# Altium project eggubator.PrjPcb
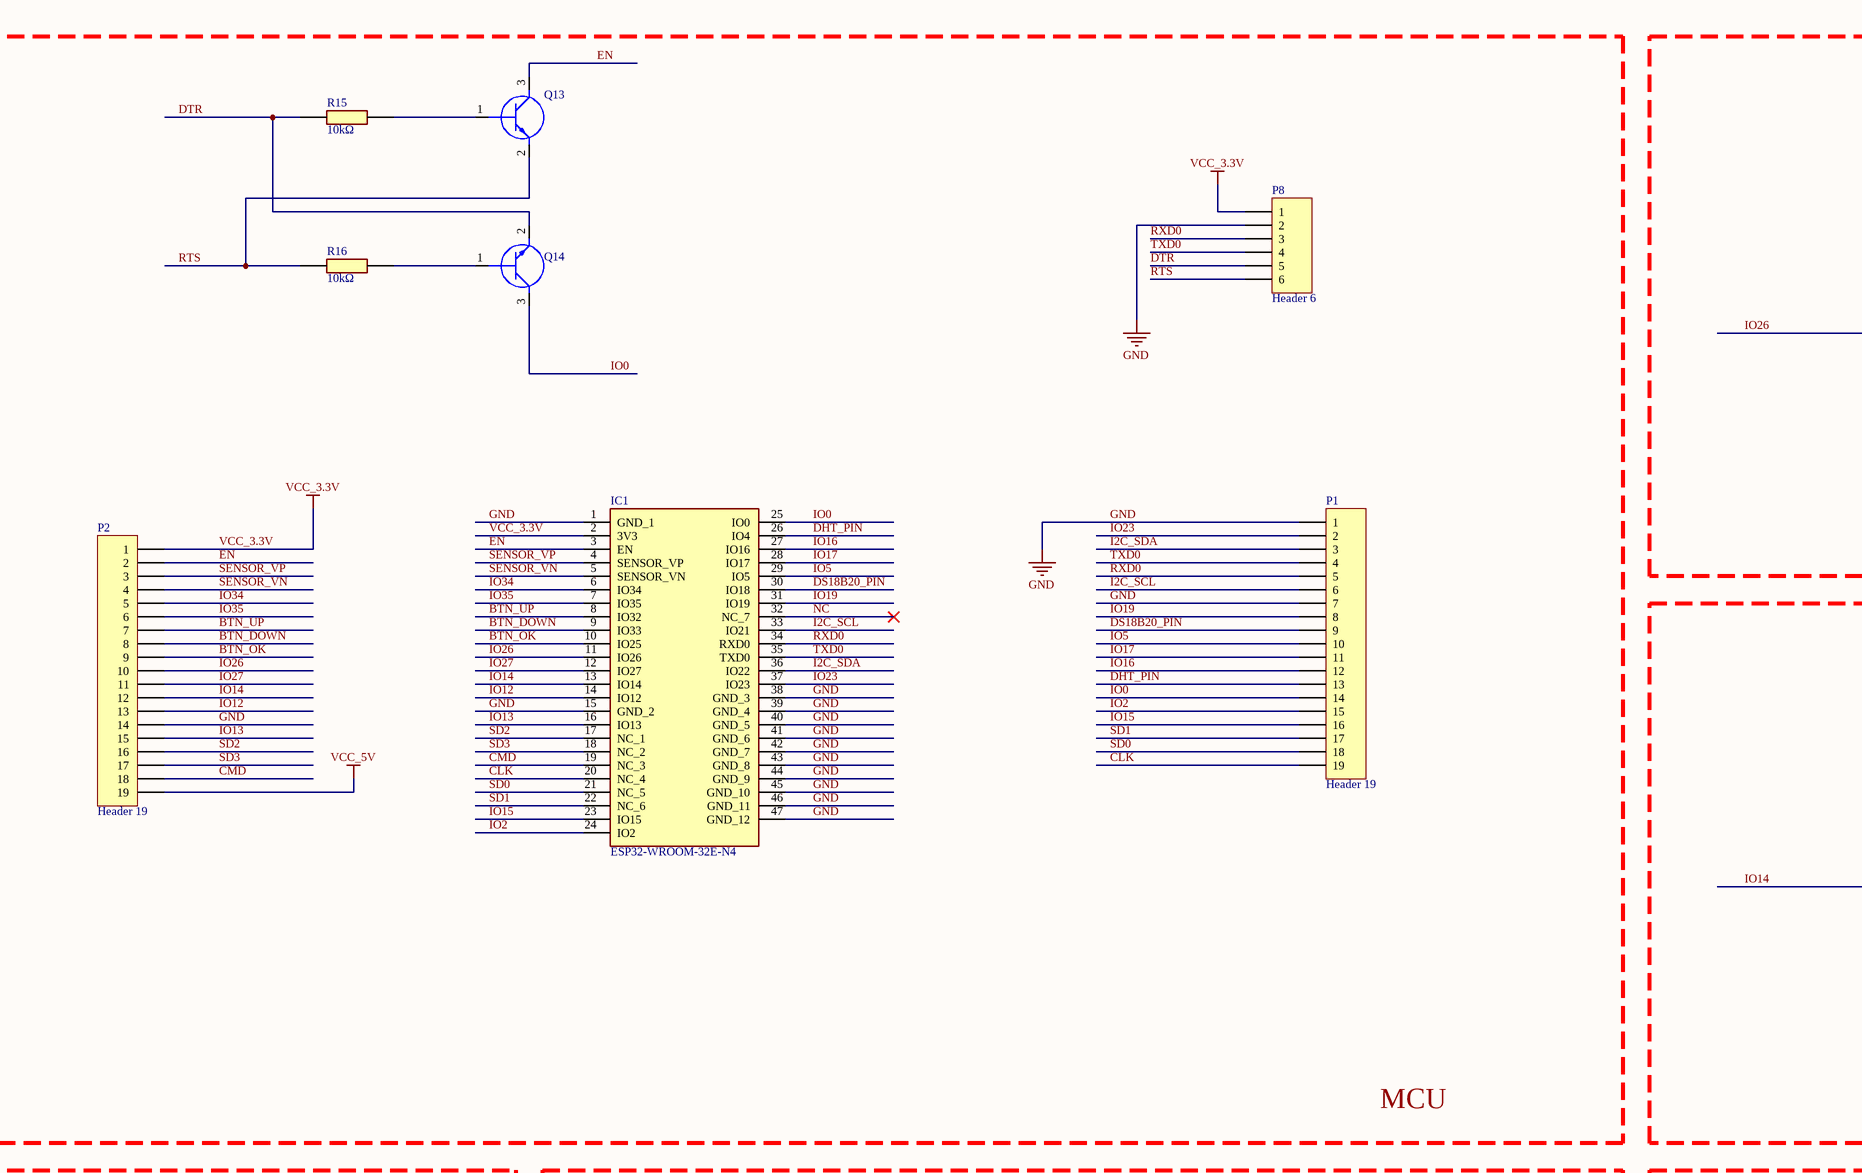
[diagram p0: MCU.SchDoc, top left]
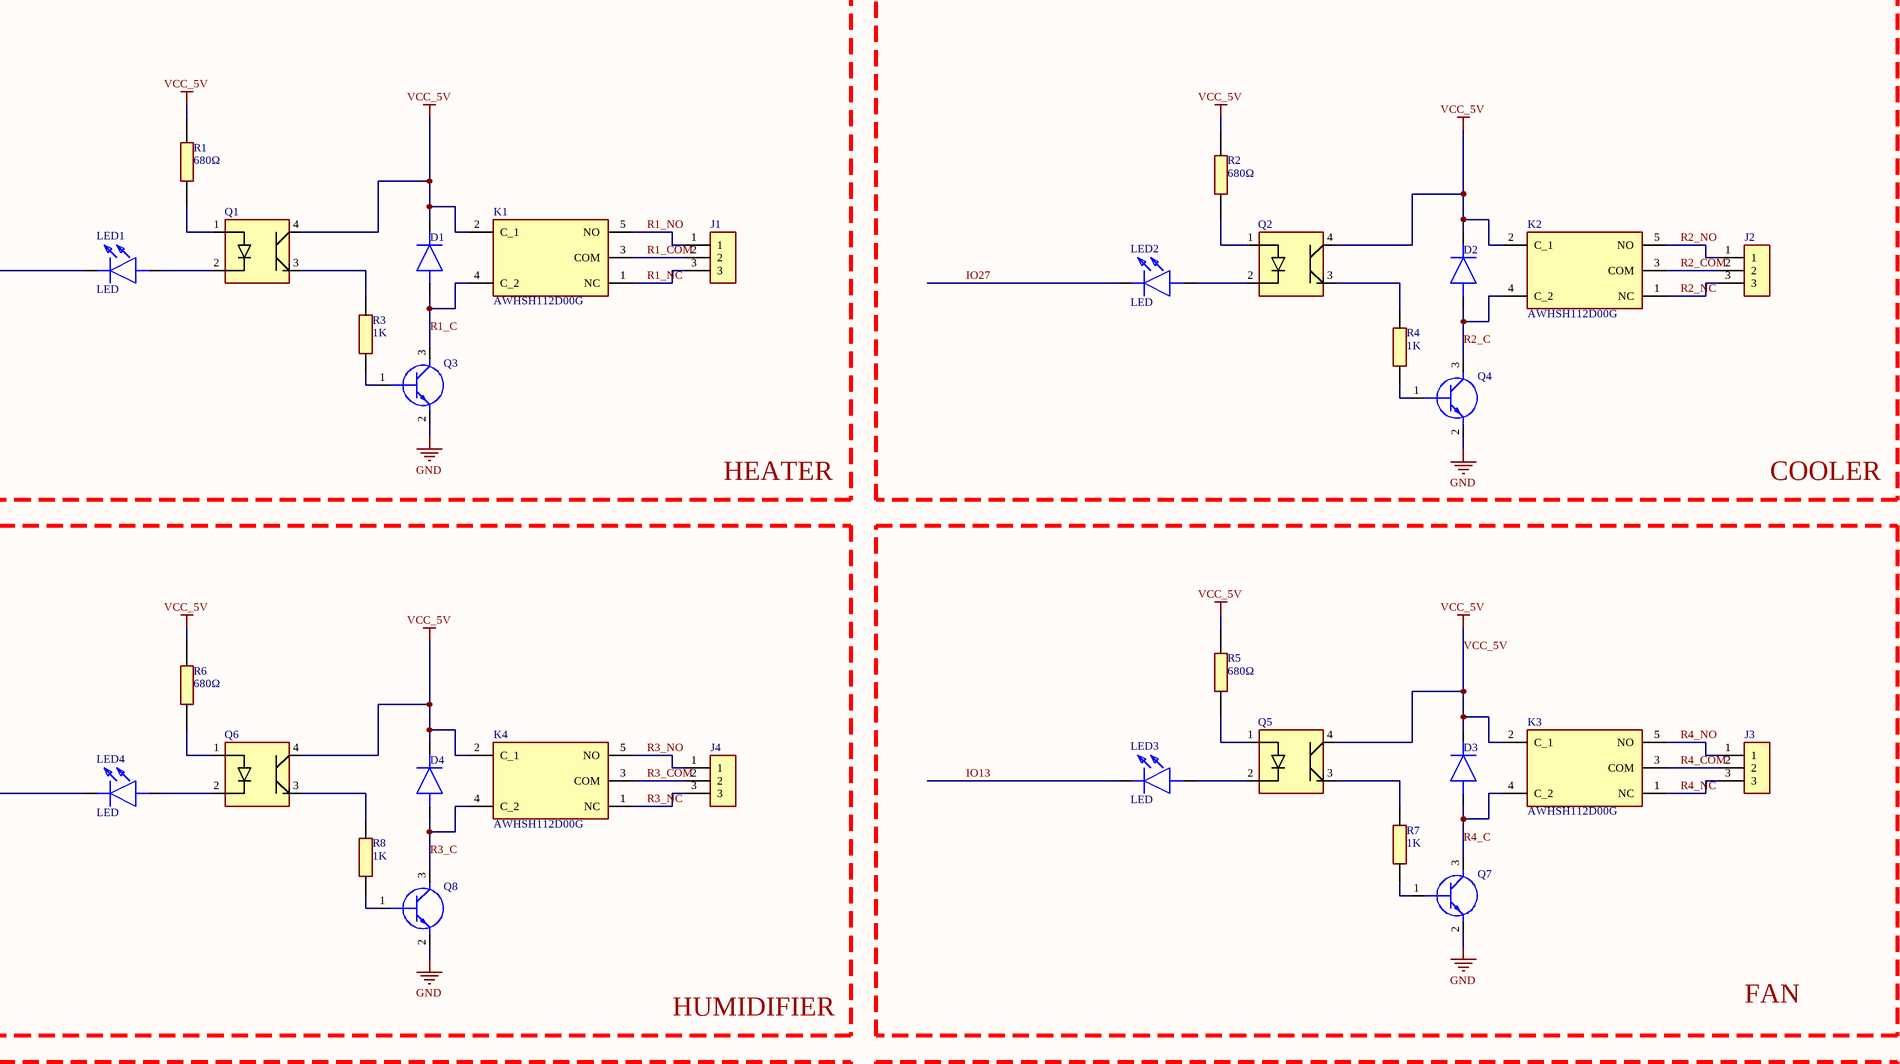
[diagram p1: MCU.SchDoc, top right]
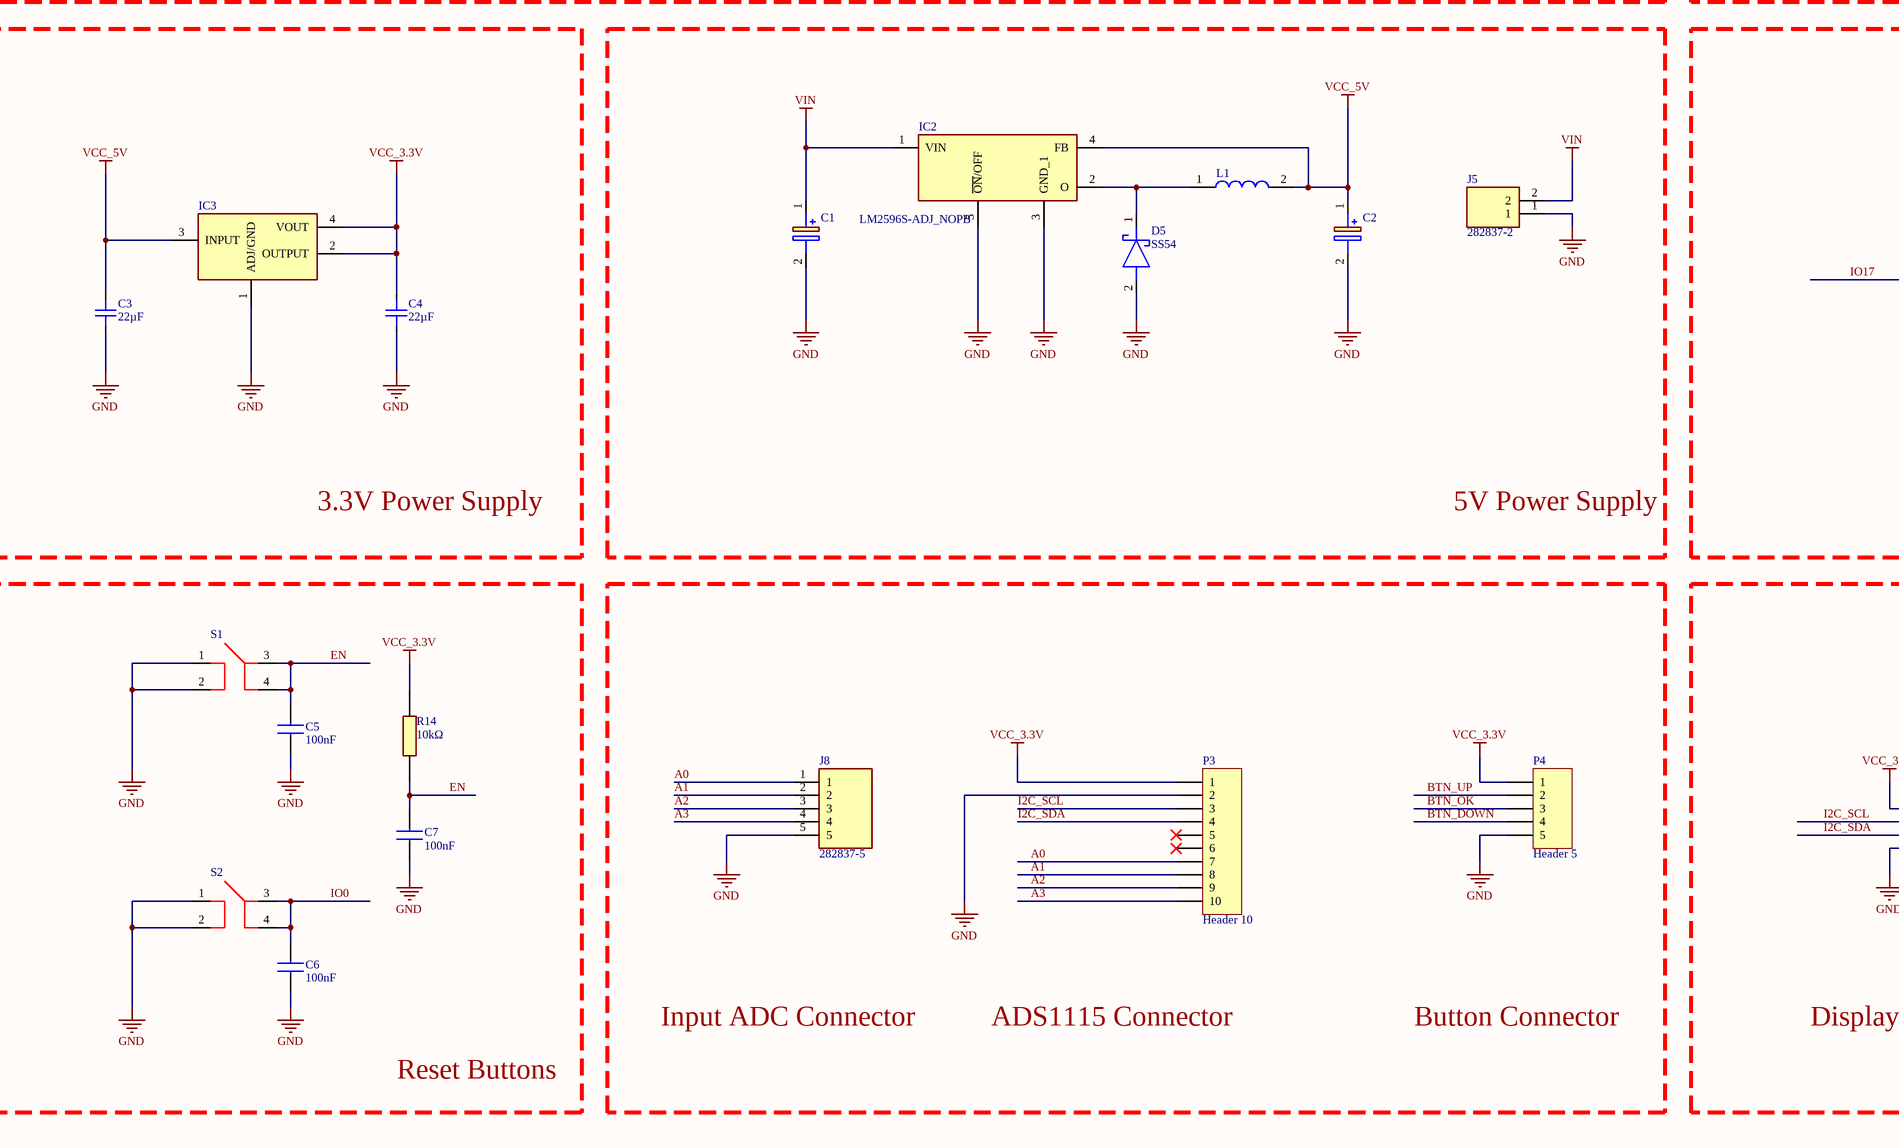
[diagram p2: MCU.SchDoc, bottom left]
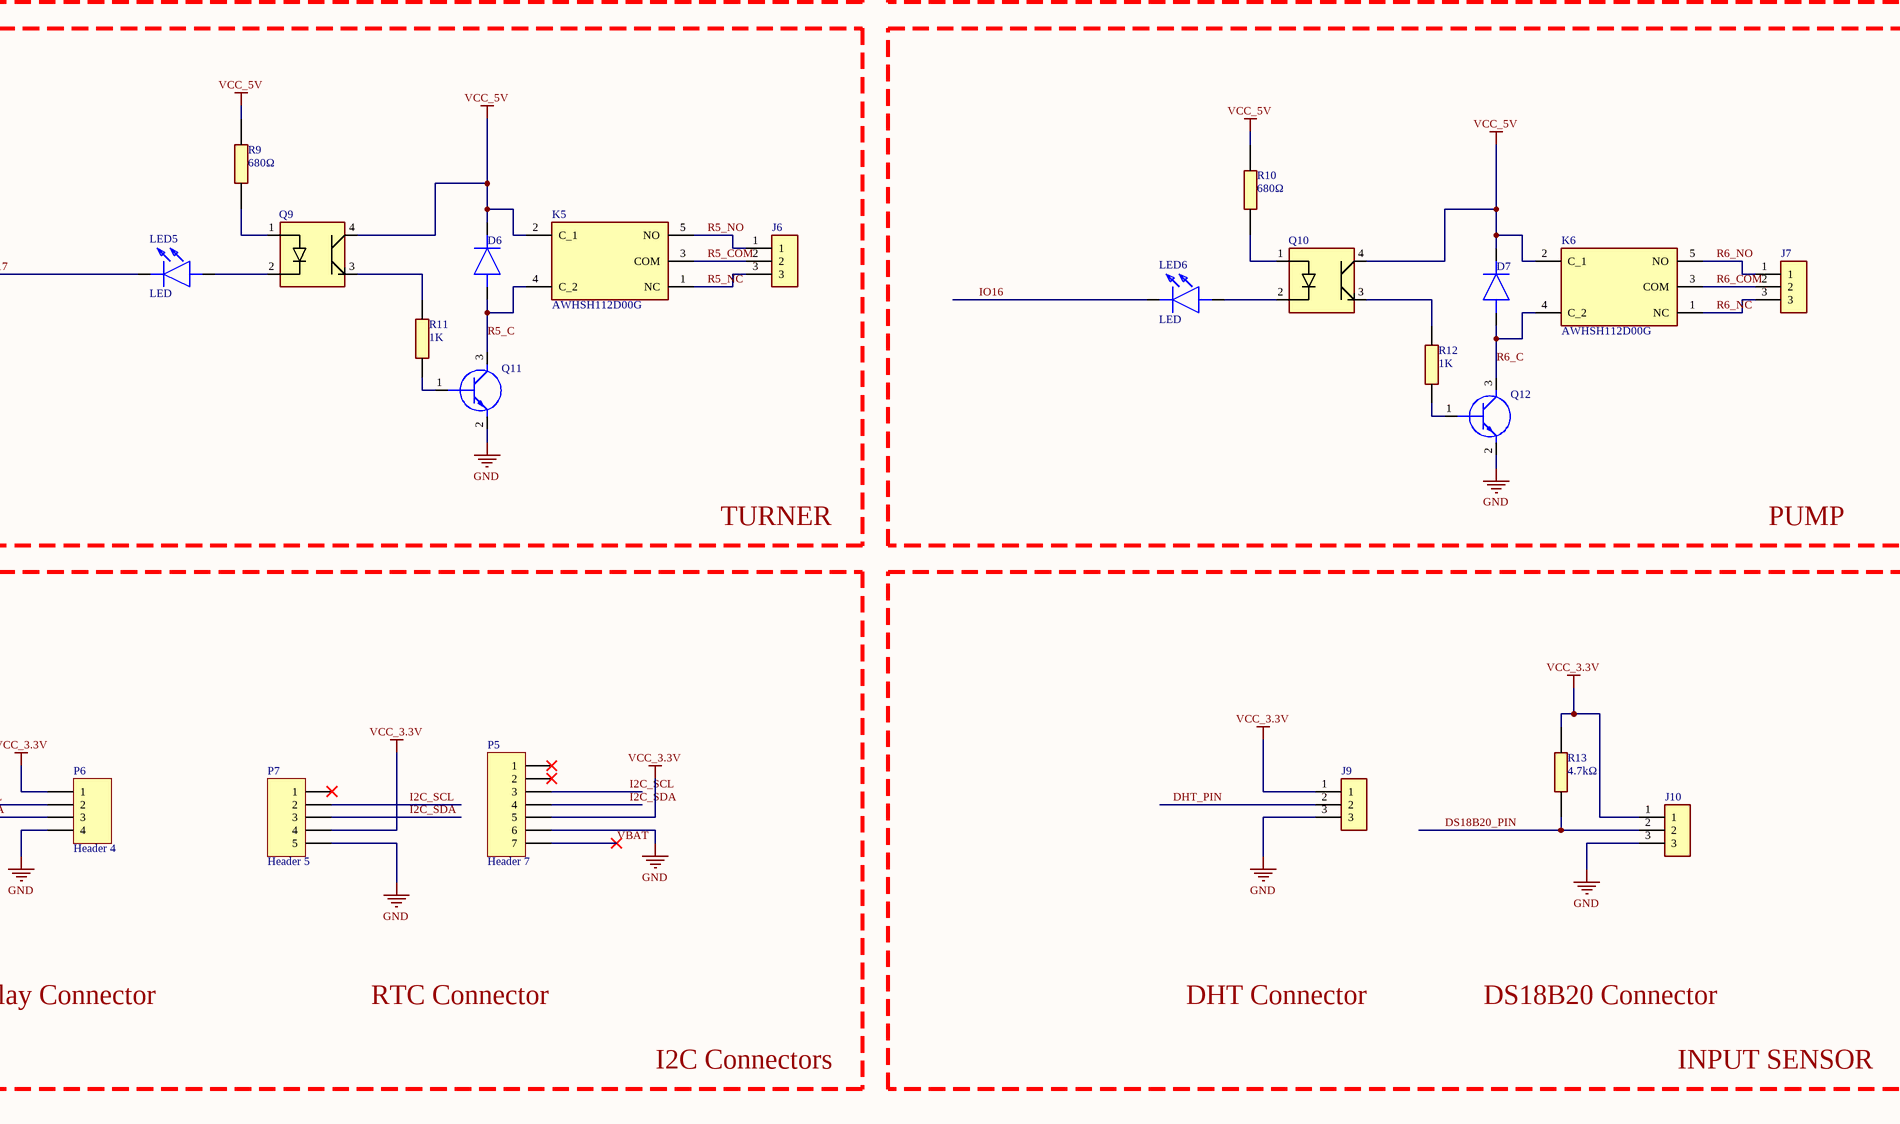
[diagram p3: MCU.SchDoc, bottom right]
1 sheet, 80 parts. Net scope: global (net labels, ports and power ports of the same name join across sheets).
Board file: eggubator.PcbDoc

## Sheet MCU.SchDoc
size A1; SheetNumber: 1; SheetTotal: 1

### Parts
C1  865060453007  [CAPAE830X1050N]  (value not drawn)
C2  865060453007  [CAPAE830X1050N]  (value not drawn)
C3  22µF  [C0805]
C4  22µF  [C0805]
C5  100nF  [C0805]
C6  100nF  [C0805]
C7  100nF  [C0805]
D1  1N4007FLTR  [SODFL3718X140N]  (value not drawn)
D2  1N4007FLTR  [SODFL3718X140N]  (value not drawn)
D3  1N4007FLTR  [SODFL3718X140N]  (value not drawn)
D4  1N4007FLTR  [SODFL3718X140N]  (value not drawn)
D5  SS54  [DIOM5026X262N]
D6  1N4007FLTR  [SODFL3718X140N]  (value not drawn)
D7  1N4007FLTR  [SODFL3718X140N]  (value not drawn)
IC1  ESP32-WROOM-32E-N4  [ESP32WROOM32EN4]
IC2  LM2596S-ADJ_NOPB  [LM2596SXADJ]
IC3  LM1117IMPX3.3_NOPB  [SOT230P700X180-4N]  (value not drawn)
J1  691137710003  [691137710003]  (value not drawn)
J2  691137710003  [691137710003]  (value not drawn)
J3  691137710003  [691137710003]  (value not drawn)
J4  691137710003  [691137710003]  (value not drawn)
J5  282837-2  [2828372]
J6  691137710003  [691137710003]  (value not drawn)
J7  691137710003  [691137710003]  (value not drawn)
J8  282837-5  [2828375]
J9  691137710003  [691137710003]  (value not drawn)
J10  691137710003  [691137710003]  (value not drawn)
K1  AWHSH112D00G  [AWHSH112D00G]
K2  AWHSH112D00G  [AWHSH112D00G]
K3  AWHSH112D00G  [AWHSH112D00G]
K4  AWHSH112D00G  [AWHSH112D00G]
K5  AWHSH112D00G  [AWHSH112D00G]
K6  AWHSH112D00G  [AWHSH112D00G]
L1  CDRH104RNP-331NC  [CDRH104RNP331NC]  (value not drawn)
LED1  LED  [XZMDK54W4]
LED2  LED  [XZMDK54W4]
LED3  LED  [XZMDK54W4]
LED4  LED  [XZMDK54W4]
LED5  LED  [XZMDK54W4]
LED6  LED  [XZMDK54W4]
P1  Header 19  [HDR1X19]
P2  Header 19  [HDR1X19]
P3  Header 10  [HDR1X10]
P4  Header 5  [HDR1X5]
P5  Header 7  [HDR1X7]
P6  Header 4  [HDR1X4]
P7  Header 5  [HDR1X5]
P8  Header 6  [HDR1X6]
Q1  APC-817C1-SL  [APC817C1SL]  (value not drawn)
Q2  APC-817C1-SL  [APC817C1SL]  (value not drawn)
Q3  MMBT2222A-G  [SOT95P240X115-3N]  (value not drawn)
Q4  MMBT2222A-G  [SOT95P240X115-3N]  (value not drawn)
Q5  APC-817C1-SL  [APC817C1SL]  (value not drawn)
Q6  APC-817C1-SL  [APC817C1SL]  (value not drawn)
Q7  MMBT2222A-G  [SOT95P240X115-3N]  (value not drawn)
Q8  MMBT2222A-G  [SOT95P240X115-3N]  (value not drawn)
Q9  APC-817C1-SL  [APC817C1SL]  (value not drawn)
Q10  APC-817C1-SL  [APC817C1SL]  (value not drawn)
Q11  MMBT2222A-G  [SOT95P240X115-3N]  (value not drawn)
Q12  MMBT2222A-G  [SOT95P240X115-3N]  (value not drawn)
Q13  MMBT2222A-G  [SOT95P240X115-3N]  (value not drawn)
Q14  MMBT2222A-G  [SOT95P240X115-3N]  (value not drawn)
R1  680Ω  [RES 0805_2012 RF]
R2  680Ω  [RES 0805_2012 RF]
R3  1K  [RESC2012X60N]
R4  1K  [RESC2012X60N]
R5  680Ω  [RES 0805_2012 RF]
R6  680Ω  [RES 0805_2012 RF]
R7  1K  [RESC2012X60N]
R8  1K  [RESC2012X60N]
R9  680Ω  [RES 0805_2012 RF]
R10  680Ω  [RES 0805_2012 RF]
R11  1K  [RESC2012X60N]
R12  1K  [RESC2012X60N]
R13  4.7kΩ  [RES 0805_2012 RF]
R14  10kΩ  [RESC2012X60N]
R15  10kΩ  [RESC2012X60N]
R16  10kΩ  [RESC2012X60N]
S1  TL1105AF160Q  [TL1105AF160Q]  (value not drawn)
S2  TL1105AF160Q  [TL1105AF160Q]  (value not drawn)

### Blocks framed on the sheet
MCU: IC1 P1 P2 P8 Q13 Q14 R15 R16
HEATER: D1 J1 K1 LED1 Q1 Q3 R1 R3
COOLER: D2 J2 K2 LED2 Q2 Q4 R2 R4
HUMIDIFIER: D4 J4 K4 LED4 Q6 Q8 R6 R8
FAN: D3 J3 K3 LED3 Q5 Q7 R5 R7
3.3V Power Supply: C3 C4 IC3
5V Power Supply: C1 C2 D5 IC2 J5 L1
TURNER: D6 J6 K5 LED5 Q9 Q11 R9 R11
PUMP: D7 J7 K6 LED6 Q10 Q12 R10 R12
Reset Buttons: C5-C7 R14 S1 S2

### Nets
GND: C1.2(-) C2.2(-) C3.1 C4.1 C5.2 C6.2 C7.2 D5.2(A) IC1.1(GND_1) IC1.15(GND_2) IC1.38(GND_3) IC1.39(GND_4) IC1.40(GND_5) IC1.41(GND_6) IC1.42(GND_7) IC1.43(GND_8) IC1.44(GND_9) IC1.45(GND_10) IC1.46(GND_11) IC1.47(GND_12) IC2.3(GND_1) IC2.5(~{ON}/OFF) IC3.1(ADJ/GND) J5.1 J8.5 J9.3 J10.3 P1.1 P1.7 P2.14 P3.2 P4.5 P5.6 P6.4 P7.5 P8.2 Q3.2(E) Q4.2(E) Q7.2(E) Q8.2(E) Q11.2(E) Q12.2(E) S1.1(COM_1) S1.2(COM_2) S2.1(COM_1) S2.2(COM_2)
VCC_3.3V: C4.2 IC1.2(3V3) IC3.2(OUTPUT) IC3.4(VOUT) J9.1 J10.1 P2.1 P3.1 P4.1 P5.5 P6.1 P7.4 P8.1 R13.2 R14.2
VCC_5V: C2.1(+) C3.2 D1.1(K) D2.1(K) D3.1(K) D4.1(K) D6.1(K) D7.1(K) IC2.4(FB) IC3.3(INPUT) K1.2(C_1) K2.2(C_1) K3.2(C_1) K4.2(C_1) K5.2(C_1) K6.2(C_1) L1.2 P2.19 Q1.4(COLLECTOR) Q2.4(COLLECTOR) Q5.4(COLLECTOR) Q6.4(COLLECTOR) Q9.4(COLLECTOR) Q10.4(COLLECTOR) R1.2 R2.2 R5.2 R6.2 R9.2 R10.2
VIN: C1.1(+) IC2.1(VIN) J5.2
A0: J8.1 P3.7
A1: J8.2 P3.8
A2: J8.3 P3.9
A3: J8.4 P3.10
BTN_DOWN: IC1.9(IO33) P2.8 P4.4
BTN_OK: IC1.10(IO25) P2.9 P4.3
BTN_UP: IC1.8(IO32) P2.7 P4.2
CLK: IC1.20(NC_4) P1.19
CMD: IC1.19(NC_3) P2.18
DHT_PIN: IC1.26(IO4) J9.2 P1.13
DS18B20_PIN: IC1.30(IO18) J10.2 P1.9 R13.1
DTR: P8.5 Q14.2(E) R15.2
EN: C5.1 C7.1 IC1.3(EN) P2.2 Q13.3(C) R14.1 S1.3(NO_1) S1.4(NO_2)
I2C_SCL: IC1.33(IO21) P1.6 P3.3 P5.3 P6.2 P7.2
I2C_SDA: IC1.36(IO22) P1.3 P3.4 P5.4 P6.3 P7.3
IO0: C6.1 IC1.25(IO0) P1.14 Q14.3(C) S2.3(NO_1) S2.4(NO_2)
IO2: IC1.24(IO2) P1.15
IO5: IC1.29(IO5) P1.10
IO12: IC1.14(IO12) P2.13
IO13: IC1.16(IO13) LED3.1(K) P2.15
IO14: IC1.13(IO14) LED4.1(K) P2.12
IO15: IC1.23(IO15) P1.16
IO16: IC1.27(IO16) LED6.1(K) P1.12
IO17: IC1.28(IO17) LED5.1(K) P1.11
IO19: IC1.31(IO19) P1.8
IO23: IC1.37(IO23) P1.2
IO26: IC1.11(IO26) LED1.1(K) P2.10
IO27: IC1.12(IO27) LED2.1(K) P2.11
IO34: IC1.6(IO34) P2.5
IO35: IC1.7(IO35) P2.6
NC: IC1.32(NC_7)
R1_C: D1.2(A) K1.4(C_2) Q3.3(C)
R1_COM: J1.2 K1.3(COM)
R1_NC: J1.3 K1.1(NC)
R1_NO: J1.1 K1.5(NO)
R2_C: D2.2(A) K2.4(C_2) Q4.3(C)
R2_COM: J2.2 K2.3(COM)
R2_NC: J2.3 K2.1(NC)
R2_NO: J2.1 K2.5(NO)
R3_C: D4.2(A) K4.4(C_2) Q8.3(C)
R3_COM: J4.2 K4.3(COM)
R3_NC: J4.3 K4.1(NC)
R3_NO: J4.1 K4.5(NO)
R4_C: D3.2(A) K3.4(C_2) Q7.3(C)
R4_COM: J3.2 K3.3(COM)
R4_NC: J3.3 K3.1(NC)
R4_NO: J3.1 K3.5(NO)
R5_C: D6.2(A) K5.4(C_2) Q11.3(C)
R5_COM: J6.2 K5.3(COM)
R5_NC: J6.3 K5.1(NC)
R5_NO: J6.1 K5.5(NO)
R6_C: D7.2(A) K6.4(C_2) Q12.3(C)
R6_COM: J7.2 K6.3(COM)
R6_NC: J7.3 K6.1(NC)
R6_NO: J7.1 K6.5(NO)
RTS: P8.6 Q13.2(E) R16.2
RXD0: IC1.34(RXD0) P1.5 P8.3
SD0: IC1.21(NC_5) P1.18
SD1: IC1.22(NC_6) P1.17
SD2: IC1.17(NC_1) P2.16
SD3: IC1.18(NC_2) P2.17
SENSOR_VN: IC1.5(SENSOR_VN) P2.4
SENSOR_VP: IC1.4(SENSOR_VP) P2.3
TXD0: IC1.35(TXD0) P1.4 P8.4
VBAT: P5.7
NetD5_1: D5.1(K) IC2.2(O) L1.1
NetLED1_2: LED1.2(A) Q1.2(CATHODE)
NetLED2_2: LED2.2(A) Q2.2(CATHODE)
NetLED3_2: LED3.2(A) Q5.2(CATHODE)
NetLED4_2: LED4.2(A) Q6.2(CATHODE)
NetLED5_2: LED5.2(A) Q9.2(CATHODE)
NetLED6_2: LED6.2(A) Q10.2(CATHODE)
NetQ1_1: Q1.1(ANODE) R1.1
NetQ1_3: Q1.3(EMITTER) R3.2
NetQ2_1: Q2.1(ANODE) R2.1
NetQ2_3: Q2.3(EMITTER) R4.2
NetQ3_1: Q3.1(B) R3.1
NetQ4_1: Q4.1(B) R4.1
NetQ5_1: Q5.1(ANODE) R5.1
NetQ5_3: Q5.3(EMITTER) R7.2
NetQ6_1: Q6.1(ANODE) R6.1
NetQ6_3: Q6.3(EMITTER) R8.2
NetQ7_1: Q7.1(B) R7.1
NetQ8_1: Q8.1(B) R8.1
NetQ9_1: Q9.1(ANODE) R9.1
NetQ9_3: Q9.3(EMITTER) R11.2
NetQ10_1: Q10.1(ANODE) R10.1
NetQ10_3: Q10.3(EMITTER) R12.2
NetQ11_1: Q11.1(B) R11.1
NetQ12_1: Q12.1(B) R12.1
NetQ13_1: Q13.1(B) R15.1
NetQ14_1: Q14.1(B) R16.1

Not connected (* = marked no-connect by the designer): P3 5* 6*; P5 1* 2*; P7 1*

### Notes on the sheet
- Input ADC Connector
- ADS1115 Connector
- Button Connector
- Display Connector
- RTC Connector
- DHT Connector
- DS18B20 Connector
- I2C Connectors
- INPUT SENSOR

### Library data of the parts
C1 C2 = 865060453007: Capacitor Polarised; Manufacturer_Name: Wurth Elektronik; Datasheet Link: https://www.we-online.com/catalog/datasheet/865060453007.pdf; Height: 10.5mm; Manufacturer_Part_Number: 865060453007; Mouser Part Number: 710-865060453007; Mouser Price/Stock: https://www.mouser.co.uk/ProductDetail/Wurth-Elektronik/865060453007?qs=0KOYDY2FL2%2F7v5bvtUSDMA%3D%3D
C3 C4 = CC0805MKX5R7BB226: 16V 22uF X5R ±20% 0805 Multilayer Ceramic Capacitors MLCC - SMD/SMT ROHS; Manufacturer: Yageo Group; Manufacturer Package Identifier: 0805 (2012 metric); Supplier 1: Arrow Electronics; Manufacturer Part Number: CC0805MKX5R7BB226; RoHS: Compliant; Category: Ceramic Capacitors; Stock 1: 20; Pricing 1: 14=0.1905 (USD); Capacitance: 22µF; Case/Package: 0805; Case Code (Imperial): 0805; Case Code (Metric): 2012; China RoHS: Compliant; Composition: Ceramic; Country of Origin: Mainland China, Taiwan; Dielectric: X5R; Dielectric Material: Ceramic; Export Control Classification Number (ECCN) Code: EAR99; Halogen Free: Halogen Free; Height: 1.25mm; Harmonized Tariff Schedule (HTS) Code: 8532.24.00.20; Introduction Date: 2014-07-08; Lead Free: Lead Free; Length: 2mm; Lifecycle Status: Production; Max Operating Temperature: 85°C; Min Operating Temperature: -55°C; Mount: Surface Mount; Number of Terminals: 2; Packaging: Tape & Reel (TR); REACH SVHC: Yes; Termination: SMD/SMT; Thickness: 1.4478mm; Tolerance: 20%; Voltage Rating: 16V; Voltage Rating (DC): 16V; Weight: 5.499807mg; Width: 1.25mm; ComponentLink1URL: https://datasheet.octopart.com:443/CC0805MKX5R7BB226-Yageo-datasheet-170350636.pdf?src-supplier=IHS; ComponentLink1Description: https://datasheet.octopart.com:443/CC0805MKX5R7BB226-Yageo-datasheet-170350636.pdf?src-supplier=IHS; ComponentLink2URL: https://datasheet.octopart.com:443/CC0805MKX5R7BB226-Yageo-datasheet-181969992.pdf?src-supplier=Farnell; ComponentLink2Description: https://datasheet.octopart.com:443/CC0805MKX5R7BB226-Yageo-datasheet-181969992.pdf?src-supplier=Farnell; ComponentLink3URL: https://datasheet.octopart.com:443/CC0805MKX5R7BB226-Yageo-datasheet-145016144.pdf?src-supplier=ODG+(Origin+Data+Global); ComponentLink3Description: https://datasheet.octopart.com:443/CC0805MKX5R7BB226-Yageo-datasheet-145016144.pdf?src-supplier=ODG+(Origin+Data+Global); ComponentLink4URL: https://datasheet.octopart.com/CC0805MKX5R7BB226-Yageo-datasheet-86397281.pdf; ComponentLink4Description: https://datasheet.octopart.com/CC0805MKX5R7BB226-Yageo-datasheet-86397281.pdf; ComponentLink5URL: https://datasheet.octopart.com:443/CC0805MKX5R7BB226-Yageo-Group-datasheet-175963154.pdf?src-supplier=Newark; ComponentLink5Description: https://datasheet.octopart.com:443/CC0805MKX5R7BB226-Yageo-Group-datasheet-175963154.pdf?src-supplier=Newark; ComponentLink6URL: https://datasheet.octopart.com:443/CC0805MKX5R7BB226-Yageo-datasheet-59875459.pdf?src-supplier=Future+Electronics; ComponentLink6Description: https://datasheet.octopart.com:443/CC0805MKX5R7BB226-Yageo-datasheet-59875459.pdf?src-supplier=Future+Electronics; ComponentLink7URL: https://datasheet.octopart.com:443/CC0805MKX5R7BB226-Yageo-datasheet-62058312.pdf?src-supplier=Future+Electronics; ComponentLink7Description: https://datasheet.octopart.com:443/CC0805MKX5R7BB226-Yageo-datasheet-62058312.pdf?src-supplier=Future+Electronics; ComponentLink8URL: https://datasheet.octopart.com:443/CC0805MKX5R7BB226-Yageo-datasheet-62067349.pdf?src-supplier=Future+Electronics; ComponentLink8Description: https://datasheet.octopart.com:443/CC0805MKX5R7BB226-Yageo-datasheet-62067349.pdf?src-supplier=Future+Electronics; ComponentLink9URL: https://datasheet.octopart.com:443/CC0805MKX5R7BB226-Yageo-Group-datasheet-192360830.pdf?src-supplier=Future+Electronics; ComponentLink9Description: https://datasheet.octopart.com:443/CC0805MKX5R7BB226-Yageo-Group-datasheet-192360830.pdf?src-supplier=Future+Electronics; ComponentLink10URL: http://sigma.octopart.com:80/conflict_mineral_statement/Yageo-company-3.pdf?src-supplier=Compliance+Statements; ComponentLink10Description: http://sigma.octopart.com:80/conflict_mineral_statement/Yageo-company-3.pdf?src-supplier=Compliance+Statements; ComponentLink11URL: http://sigma.octopart.com:80/rohs_statement/Yageo-company-2.pdf?src-supplier=Compliance+Statements; ComponentLink11Description: http://sigma.octopart.com:80/rohs_statement/Yageo-company-2.pdf?src-supplier=Compliance+Statements; Supplier Part Number 1: CC0805MKX5R7BB226
C5-C7 = C0805C104K5RACTU: 50V 100nF X7R ±10% 0805 Multilayer Ceramic Capacitors MLCC - SMD/SMT ROHS; Manufacturer: Yageo Group; Temperature Coefficient: 30ppm/°C; Voltage: 500V; Supplier 1: Arrow Electronics; Manufacturer Part Number: C0805C104K5RACTU; RoHS: Compliant; Category: Ceramic Capacitors; Stock 1: 5364000; Pricing 1: 4000=0.0178 (USD); Capacitance: 100nF; Case/Package: 0805; Case Code (Imperial): 0805; China RoHS: Compliant; Contact Plating: Tin; Country of Origin: Mainland China; Depth: 1.25mm; Dielectric: X7R; Dielectric Material: Ceramic; Export Control Classification Number (ECCN) Code: EAR99; Height: 780µm; Harmonized Tariff Schedule (HTS) Code: 8532.24.00.20; Introduction Date: 2001-04-27; Lead Free: Lead Free; Lead Pitch: 750µm; Length: 2mm; Lifecycle Status: Production; Material: Ceramic; Max Operating Temperature: 125°C; Min Operating Temperature: -55°C; Mount: Surface Mount; Number of Pins: 2; Number of Terminals: 2; Packaging: Cut Tape; Radiation Hardening: No; REACH SVHC: Yes; Schedule B: 8532240020, 8532240020|8532240020, 8532240020|8532240020|8532240020, 8532240020|8532240020|8532240020|8532240020; Termination: SMD/SMT; Thickness: 889µm; Tolerance: 10%; Voltage Rating: 50V; Voltage Rating (DC): 50V; Width: 1.25mm; ComponentLink1URL: https://datasheet.octopart.com:443/C0805C104K5RACTU-KEMET-datasheet-178445679.pdf?src-supplier=IHS; ComponentLink1Description: https://datasheet.octopart.com:443/C0805C104K5RACTU-KEMET-datasheet-178445679.pdf?src-supplier=IHS; ComponentLink2URL: https://datasheet.octopart.com:443/C0805C104K5RAC7800-KEMET-datasheet-182041128.pdf?src-supplier=IHS; ComponentLink2Description: https://datasheet.octopart.com:443/C0805C104K5RAC7800-KEMET-datasheet-182041128.pdf?src-supplier=IHS; ComponentLink3URL: https://datasheet.octopart.com:443/C0805C104K5RACTU-KEMET-datasheet-137357759.pdf?src-supplier=Upverter; ComponentLink3Description: https://datasheet.octopart.com:443/C0805C104K5RACTU-KEMET-datasheet-137357759.pdf?src-supplier=Upverter; ComponentLink4URL: https://datasheet.octopart.com:443/C0805C104K5RACTU-KEMET-datasheet-68331921.pdf?src-supplier=Upverter; ComponentLink4Description: https://datasheet.octopart.com:443/C0805C104K5RACTU-KEMET-datasheet-68331921.pdf?src-supplier=Upverter; ComponentLink5URL: https://datasheet.octopart.com:443/C0805C104K5RAC-TU-Kemet-datasheet-5313890.pdf?src-supplier=Newark; ComponentLink5Description: https://datasheet.octopart.com:443/C0805C104K5RAC-TU-Kemet-datasheet-5313890.pdf?src-supplier=Newark; ComponentLink6URL: https://datasheet.octopart.com:443/C0805C104K5RAC-TU-Kemet-datasheet-5390537.pdf?src-supplier=Newark; ComponentLink6Description: https://datasheet.octopart.com:443/C0805C104K5RAC-TU-Kemet-datasheet-5390537.pdf?src-supplier=Newark; ComponentLink7URL: https://datasheet.octopart.com:443/C0805C104K5RAC-TU-Kemet-datasheet-7541751.pdf?src-supplier=Newark; ComponentLink7Description: https://datasheet.octopart.com:443/C0805C104K5RAC-TU-Kemet-datasheet-7541751.pdf?src-supplier=Newark; ComponentLink8URL: https://datasheet.octopart.com:443/C0805C104K5RACTU-KEMET-datasheet-170667449.pdf?src-supplier=Newark; ComponentLink8Description: https://datasheet.octopart.com:443/C0805C104K5RACTU-KEMET-datasheet-170667449.pdf?src-supplier=Newark; ComponentLink9URL: https://datasheet.octopart.com:443/C0805C104K5RACTU-Kemet-datasheet-14356739.pdf?src-supplier=Newark; ComponentLink9Description: https://datasheet.octopart.com:443/C0805C104K5RACTU-Kemet-datasheet-14356739.pdf?src-supplier=Newark; ComponentLink10URL: https://datasheet.octopart.com:443/C0805C104K5RACTU-Kemet-datasheet-8764837.pdf?src-supplier=Newark; ComponentLink10Description: https://datasheet.octopart.com:443/C0805C104K5RACTU-Kemet-datasheet-8764837.pdf?src-supplier=Newark; ComponentLink11URL: https://datasheet.octopart.com:443/C0805C104K5RACTU-Kemet-datasheet-8480123.pdf?src-supplier=Newark; ComponentLink11Description: https://datasheet.octopart.com:443/C0805C104K5RACTU-Kemet-datasheet-8480123.pdf?src-supplier=Newark; ComponentLink12URL: https://datasheet.octopart.com:443/C0805C104K5RACTU-Kemet-datasheet-5393970.pdf?src-supplier=Newark; ComponentLink12Description: https://datasheet.octopart.com:443/C0805C104K5RACTU-Kemet-datasheet-5393970.pdf?src-supplier=Newark; ComponentLink13URL: https://datasheet.octopart.com:443/C0805C104K5RACTU-Kemet-datasheet-8502025.pdf?src-supplier=Newark; ComponentLink13Description: https://datasheet.octopart.com:443/C0805C104K5RACTU-Kemet-datasheet-8502025.pdf?src-supplier=Newark; ComponentLink14URL: https://datasheet.octopart.com:443/C0805C104K5RACTU-Kemet-datasheet-161801.pdf?src-supplier=Newark; ComponentLink14Description: https://datasheet.octopart.com:443/C0805C104K5RACTU-Kemet-datasheet-161801.pdf?src-supplier=Newark; ComponentLink15URL: https://datasheet.octopart.com:443/C0805C104K5RACTU-KEMET-datasheet-101576148.pdf?src-supplier=Farnell; ComponentLink15Description: https://datasheet.octopart.com:443/C0805C104K5RACTU-KEMET-datasheet-101576148.pdf?src-supplier=Farnell; ComponentLink16URL: https://datasheet.octopart.com:443/C0805C104K5RACTU-KEMET-datasheet-176142297.pdf?src-supplier=Farnell; ComponentLink16Description: https://datasheet.octopart.com:443/C0805C104K5RACTU-KEMET-datasheet-176142297.pdf?src-supplier=Farnell; ComponentLink17URL: https://datasheet.octopart.com:443/C0805C104K5RAC-TU-Kemet-datasheet-12608295.pdf?src-supplier=Farnell; ComponentLink17Description: https://datasheet.octopart.com:443/C0805C104K5RAC-TU-Kemet-datasheet-12608295.pdf?src-supplier=Farnell; ComponentLink18URL: https://datasheet.octopart.com:443/C0805C104K5RAC-TU-Kemet-datasheet-11992184.pdf?src-supplier=Farnell; ComponentLink18Description: https://datasheet.octopart.com:443/C0805C104K5RAC-TU-Kemet-datasheet-11992184.pdf?src-supplier=Farnell; ComponentLink19URL: https://datasheet.octopart.com:443/C0805C104K5RAC-TU-Kemet-datasheet-10942409.pdf?src-supplier=Farnell; ComponentLink19Description: https://datasheet.octopart.com:443/C0805C104K5RAC-TU-Kemet-datasheet-10942409.pdf?src-supplier=Farnell; ComponentLink20URL: https://datasheet.octopart.com:443/C0805C104K5RAC-TU-Kemet-datasheet-10404442.pdf?src-supplier=Farnell; ComponentLink20Description: https://datasheet.octopart.com:443/C0805C104K5RAC-TU-Kemet-datasheet-10404442.pdf?src-supplier=Farnell; ComponentLink21URL: https://datasheet.octopart.com:443/C0805C104K5RAC-TU-Kemet-datasheet-7833651.pdf?src-supplier=Farnell; ComponentLink21Description: https://datasheet.octopart.com:443/C0805C104K5RAC-TU-Kemet-datasheet-7833651.pdf?src-supplier=Farnell; ComponentLink22URL: https://datasheet.octopart.com:443/C0805C104K5RAC-TU-Kemet-datasheet-7601896.pdf?src-supplier=Farnell; ComponentLink22Description: https://datasheet.octopart.com:443/C0805C104K5RAC-TU-Kemet-datasheet-7601896.pdf?src-supplier=Farnell; ComponentLink23URL: https://datasheet.octopart.com:443/C0805C104K5RAC-TU-Kemet-datasheet-5316294.pdf?src-supplier=Farnell; ComponentLink23Description: https://datasheet.octopart.com:443/C0805C104K5RAC-TU-Kemet-datasheet-5316294.pdf?src-supplier=Farnell; ComponentLink24URL: https://datasheet.octopart.com:443/C0805C104K5RAC-TU-Kemet-datasheet-5314837.pdf?src-supplier=Farnell; ComponentLink24Description: https://datasheet.octopart.com:443/C0805C104K5RAC-TU-Kemet-datasheet-5314837.pdf?src-supplier=Farnell; ComponentLink25URL: https://datasheet.octopart.com:443/C0805C104K5RAC-TU-Kemet-datasheet-8092359.pdf?src-supplier=Farnell; ComponentLink25Description: https://datasheet.octopart.com:443/C0805C104K5RAC-TU-Kemet-datasheet-8092359.pdf?src-supplier=Farnell; ComponentLink26URL: https://datasheet.octopart.com:443/C0805C104K5RACTU-Kemet-datasheet-5314449.pdf?src-supplier=Farnell; ComponentLink26Description: https://datasheet.octopart.com:443/C0805C104K5RACTU-Kemet-datasheet-5314449.pdf?src-supplier=Farnell; ComponentLink27URL: https://datasheet.octopart.com:443/C0805C104K5RAC-TU-Kemet-datasheet-5314969.pdf?src-supplier=Farnell; ComponentLink27Description: https://datasheet.octopart.com:443/C0805C104K5RAC-TU-Kemet-datasheet-5314969.pdf?src-supplier=Farnell; ComponentLink28URL: https://datasheet.octopart.com:443/C0805C104K5RAC-TU-Kemet-datasheet-5314627.pdf?src-supplier=Farnell; ComponentLink28Description: https://datasheet.octopart.com:443/C0805C104K5RAC-TU-Kemet-datasheet-5314627.pdf?src-supplier=Farnell; ComponentLink29URL: https://datasheet.octopart.com:443/C0805C104K5RAC-TU-Kemet-datasheet-5389132.pdf?src-supplier=Farnell; ComponentLink29Description: https://datasheet.octopart.com:443/C0805C104K5RAC-TU-Kemet-datasheet-5389132.pdf?src-supplier=Farnell; ComponentLink30URL: https://datasheet.octopart.com:443/C0805C104K5RAC-TU-Kemet-datasheet-5313836.pdf?src-supplier=Farnell; ComponentLink30Description: https://datasheet.octopart.com:443/C0805C104K5RAC-TU-Kemet-datasheet-5313836.pdf?src-supplier=Farnell; ComponentLink31URL: https://datasheet.octopart.com:443/C0805C104K5RAC-TU-Kemet-datasheet-8111010.pdf?src-supplier=Farnell; ComponentLink31Description: https://datasheet.octopart.com:443/C0805C104K5RAC-TU-Kemet-datasheet-8111010.pdf?src-supplier=Farnell; ComponentLink32URL: https://datasheet.octopart.com:443/C0805C104K5RAC-TU-Kemet-datasheet-7627733.pdf?src-supplier=Farnell; ComponentLink32Description: https://datasheet.octopart.com:443/C0805C104K5RAC-TU-Kemet-datasheet-7627733.pdf?src-supplier=Farnell; ComponentLink33URL: https://datasheet.octopart.com:443/C0805C104K5RAC-TU-Kemet-datasheet-5315946.pdf?src-supplier=Farnell; ComponentLink33Description: https://datasheet.octopart.com:443/C0805C104K5RAC-TU-Kemet-datasheet-5315946.pdf?src-supplier=Farnell; ComponentLink34URL: https://datasheet.octopart.com:443/C0805C104K5RACTU-KEMET-datasheet-37550250.pdf?src-supplier=Electro+Sonic; ComponentLink34Description: https://datasheet.octopart.com:443/C0805C104K5RACTU-KEMET-datasheet-37550250.pdf?src-supplier=Electro+Sonic; ComponentLink35URL: https://datasheet.octopart.com:443/C0805C104K5RAC-TU-Kemet-datasheet-32036385.pdf?src-supplier=element14+APAC; ComponentLink35Description: https://datasheet.octopart.com:443/C0805C104K5RAC-TU-Kemet-datasheet-32036385.pdf?src-supplier=element14+APAC; ComponentLink36URL: https://datasheet.octopart.com:443/C0805C104K5RACTU-Kemet-datasheet-22975000.pdf?src-supplier=element14+APAC; ComponentLink36Description: https://datasheet.octopart.com:443/C0805C104K5RACTU-Kemet-datasheet-22975000.pdf?src-supplier=element14+APAC; ComponentLink37URL: https://datasheet.octopart.com:443/C0805C104K5RACTU-Kemet-datasheet-22084244.pdf?src-supplier=element14+APAC; ComponentLink37Description: https://datasheet.octopart.com:443/C0805C104K5RACTU-Kemet-datasheet-22084244.pdf?src-supplier=element14+APAC; ComponentLink38URL: https://datasheet.octopart.com:443/C0805C104K5RAC7800-KEMET-datasheet-188512054.pdf?src-supplier=ODG+(Origin+Data+Global); ComponentLink38Description: https://datasheet.octopart.com:443/C0805C104K5RAC7800-KEMET-datasheet-188512054.pdf?src-supplier=ODG+(Origin+Data+Global); ComponentLink39URL: https://datasheet.octopart.com:443/C0805C104K5RACTU-KEMET-datasheet-164512540.pdf?src-supplier=TME; ComponentLink39Description: https://datasheet.octopart.com:443/C0805C104K5RACTU-KEMET-datasheet-164512540.pdf?src-supplier=TME; ComponentLink40URL: https://datasheet.octopart.com:443/C0805C104K5RACTU-Kemet-datasheet-67847106.pdf?src-supplier=TME; ComponentLink40Description: https://datasheet.octopart.com:443/C0805C104K5RACTU-Kemet-datasheet-67847106.pdf?src-supplier=TME; ComponentLink41URL: https://datasheet.octopart.com:443/C0805C104K5RACTU-KEMET-datasheet-68331906.pdf?src-supplier=TME; ComponentLink41Description: https://datasheet.octopart.com:443/C0805C104K5RACTU-KEMET-datasheet-68331906.pdf?src-supplier=TME; ComponentLink42URL: https://datasheet.octopart.com:443/C0805C104K5RACTU-KEMET-datasheet-110724412.pdf?src-supplier=RS+(Formerly+Allied+Electronics); ComponentLink42Description: https://datasheet.octopart.com:443/C0805C104K5RACTU-KEMET-datasheet-110724412.pdf?src-supplier=RS+(Formerly+Allied+Electronics); ComponentLink43URL: https://datasheet.octopart.com:443/C0805C104K5RACTU-Kemet-datasheet-464.pdf?src-supplier=RS+(Formerly+Allied+Electronics); ComponentLink43Description: https://datasheet.octopart.com:443/C0805C104K5RACTU-Kemet-datasheet-464.pdf?src-supplier=RS+(Formerly+Allied+Electronics); ComponentLink44URL: https://datasheet.octopart.com/C0805C104K5RACTU-KEMET-datasheet-84169754.pdf; ComponentLink44Description: https://datasheet.octopart.com/C0805C104K5RACTU-KEMET-datasheet-84169754.pdf; ComponentLink45URL: https://datasheet.octopart.com:443/C0805C104K5RACTU-Kemet-datasheet-13693438.pdf?src-supplier=Factory+Futures; ComponentLink45Description: https://datasheet.octopart.com:443/C0805C104K5RACTU-Kemet-datasheet-13693438.pdf?src-supplier=Factory+Futures; ComponentLink46URL: https://datasheet.octopart.com:443/C0805C104K5RAC7800-KEMET-datasheet-164857143.pdf?src-supplier=Burklin+Elektronik; ComponentLink46Description: https://datasheet.octopart.com:443/C0805C104K5RAC7800-KEMET-datasheet-164857143.pdf?src-supplier=Burklin+Elektronik; ComponentLink47URL: http://sigma.octopart.com:80/conflict_mineral_statement/Yageo-company-3.pdf?src-supplier=Compliance+Statements; ComponentLink47Description: http://sigma.octopart.com:80/conflict_mineral_statement/Yageo-company-3.pdf?src-supplier=Compliance+Statements; ComponentLink48URL: http://sigma.octopart.com:80/rohs_statement/Yageo-company-2.pdf?src-supplier=Compliance+Statements; ComponentLink48Description: http://sigma.octopart.com:80/rohs_statement/Yageo-company-2.pdf?src-supplier=Compliance+Statements; Supplier Part Number 1: C0805C104K5RAC7800
D1-D4 D6 D7 = 1N4007FLTR: Diode; Manufacturer_Name: SMC Diode Solutions; Datasheet Link: http://www.smc-diodes.com/propdf/1N4001FL-1N4007FL%20N1646%20REV.A.pdf; Height: 1.4mm; Manufacturer_Part_Number: 1N4007FLTR
D5 = SS54: Schottky Diode; Manufacturer_Name: DIYI Elec Tech; Datasheet Link: https://datasheet.lcsc.com/szlcsc/DIYI-Elec-Tech-SS54_C84165.pdf; Height: 2.62mm; Manufacturer_Part_Number: SS54
IC1 = ESP32-WROOM-32E-N4: Integrated Circuit; Manufacturer_Name: Espressif Systems; Datasheet Link: https://www.espressif.com/sites/default/files/documentation/esp32-wroom-32e_esp32-wroom-32ue_datasheet_en.pdf; Height: 3.25mm; Manufacturer_Part_Number: ESP32-WROOM-32E-N4; Mouser Part Number: 356-ESP32WRM32E132PH; Mouser Price/Stock: https://www.mouser.co.uk/ProductDetail/Espressif-Systems/ESP32-WROOM-32E-N4?qs=Li%252BoUPsLEnsPzTWsi%252BRMgQ%3D%3D
IC2 = LM2596S-ADJ_NOPB: Integrated Circuit; Manufacturer_Name: Texas Instruments; Manufacturer_Part_Number: LM2596S-ADJ/NOPB; Datasheet Link: https://www.ti.com/lit/ds/symlink/lm2596.pdf?HQS=ti-null-null-sf-df-pf-sep-wwe&ts=1592978195629; Height: 4.57mm; Mouser Part Number: 926-LM2596S-ADJ/NOPB; Mouser Price/Stock: https://www.mouser.co.uk/ProductDetail/Texas-Instruments/LM2596S-ADJ-NOPB?qs=X1J7HmVL2ZHoMN0DLDcNog%3D%3D; Arrow Part Number: LM2596S-ADJ/NOPB; Arrow Price/Stock: https://www.arrow.com/en/products/lm2596s-adjnopb_1/texas-instruments.html?utm_currency=USD&region=nac
IC3 = LM1117IMPX3.3_NOPB: Integrated Circuit; Manufacturer_Name: Texas Instruments; Manufacturer_Part_Number: LM1117IMPX3.3/NOPB; Datasheet Link: http://www.ti.com/lit/ds/symlink/lm1117.pdf; Height: 1.8mm
J1-J4 J6 J7 J9 J10 = 691137710003: Connector; Manufacturer_Name: Wurth Elektronik; Datasheet Link: https://www.we-online.com/catalog/datasheet/691137710003.pdf; Height: 11.5mm; Manufacturer_Part_Number: 691137710003; Mouser Part Number: 710-691137710003; Mouser Price/Stock: https://www.mouser.co.uk/ProductDetail/Wurth-Elektronik/691137710003?qs=lBTPRtX1sU9o6BU5kiMA0Q%3D%3D
J5 = 282837-2: Connector; Manufacturer_Name: TE Connectivity; Datasheet Link: https://www.te.com/commerce/DocumentDelivery/DDEController?Action=srchrtrv&DocNm=1-1773458-1_EURO_STYLE_QRG&DocType=Data%20Sheet&DocLang=English&PartCntxt=282837-2&DocFormat=pdf; Height: 10.3mm; Manufacturer_Part_Number: 282837-2; Mouser Part Number: 571-2828372; Mouser Price/Stock: https://www.mouser.co.uk/ProductDetail/TE-Connectivity/282837-2?qs=A%252Bip%252BNCYi6O2H0NGWOeAxg%3D%3D; Arrow Part Number: 282837-2; Arrow Price/Stock: https://www.arrow.com/en/products/282837-2_1/te-connectivity.html?utm_currency=USD&region=europe
J8 = 282837-5: Connector; Manufacturer_Name: TE Connectivity; Datasheet Link: https://www.te.com/commerce/DocumentDelivery/DDEController?Action=srchrtrv&DocNm=1-1773458-1_EURO_STYLE_QRG&DocType=Data%20Sheet&DocLang=English&PartCntxt=282837-5&DocFormat=pdf; Height: 10.3mm; Manufacturer_Part_Number: 282837-5; Mouser Part Number: 571-2828375; Mouser Price/Stock: https://www.mouser.co.uk/ProductDetail/TE-Connectivity/282837-5?qs=A%252Bip%252BNCYi6MoalTIA9eyLA%3D%3D; Arrow Part Number: 282837-5; Arrow Price/Stock: https://www.arrow.com/en/products/282837-5_1/te-connectivity.html?utm_currency=USD
K1-K6 = AWHSH112D00G: Relay or Contactor; Manufacturer_Name: Amphenol; Datasheet Link: http://www.anytek.com.tw/Upload/CR(3)_AWHSH112D00G-f8b66dccaa4a4882b3087d859dc2bda8.pdf; Height: 15.3mm; Manufacturer_Part_Number: AWHSH112D00G; Mouser Part Number: 523-AWHSH112D00G; Mouser Price/Stock: https://www.mouser.co.uk/ProductDetail/Amphenol-Anytek/AWHSH112D00G?qs=rSMjJ%252B1ewcSWmP7smrZ3dA%3D%3D
L1 = CDRH104RNP-331NC: Inductor; Manufacturer_Name: Sumida; Datasheet Link: https://products.sumida.com/products/pdf/CDRH104R.pdf; Height: 4mm; Manufacturer_Part_Number: CDRH104RNP-331NC; Mouser Part Number: 851-CDRH104RNP-331NC; Mouser Price/Stock: https://www.mouser.co.uk/ProductDetail/Sumida/CDRH104RNP-331NC?qs=uLIFG%252B79HqEjY8J4po5V3w%3D%3D; Arrow Part Number: CDRH104RNP-331NC; Arrow Price/Stock: https://www.arrow.com/en/products/cdrh104rnp-331nc/sumida.html?utm_currency=USD&region=nac
LED1-LED6 = XZMDK54W-4: Single Color LED, Red, Water Clear, 1.3mm; Manufacturer_Name: SunLED; Forward Current: 30mA; Luminous Intensity: 149mcd; Number of Circuits: 1; Peak Wavelength: 650nm; Shape: Rectangular; Viewing Angle: 110°; Datasheet Link: https://www.sunledusa.com/products/spec/XZMDK54W-4.pdf; Height: 0.5mm; Manufacturer_Part_Number: XZMDK54W-4; Supplier 1: DigiKey; Manufacturer: SunLED; Manufacturer Part Number: XZMDK54W-4; RoHS: Compliant; Category: LEDs; Stock 1: 23282; Pricing 1: 1=0.21, 10=0.143, 100=0.0996, 500=0.07964, 1000=0.07301 (USD); China RoHS: Compliant; Color: Red; Country of Origin: Mainland China; Harmonized Tariff Schedule (HTS) Code: 8541.40.20.00; Introduction Date: 2004-09-24; Lifecycle Status: Production; Max Operating Temperature: 85°C; Min Operating Temperature: -40°C; Mount: Surface Mount; Number of Terminals: 2; REACH SVHC: Yes; Terminal Pitch: 2.1mm; Wavelength: 650nm; ComponentLink1URL: https://datasheet.octopart.com:443/XZMDK54W-4-SunLED-datasheet-181251984.pdf?src-supplier=IHS; ComponentLink1Description: https://datasheet.octopart.com:443/XZMDK54W-4-SunLED-datasheet-181251984.pdf?src-supplier=IHS; ComponentLink2URL: https://datasheet.octopart.com:443/XZMDK54W-4-SunLED-datasheet-142371012.pdf?src-supplier=SunLED+SCT; ComponentLink2Description: https://datasheet.octopart.com:443/XZMDK54W-4-SunLED-datasheet-142371012.pdf?src-supplier=SunLED+SCT; Supplier Part Number 1: 1497-XZMDK54W-4CT-ND
P1 P2 = Header 19: Header, 19-Pin; LatestRevisionDate: 17-Jul-2002; LatestRevisionNote: Re-released for DXP Platform.; Publisher: Altium Limited
P3 = Header 10: Header, 10-Pin; LatestRevisionDate: 17-Jul-2002; LatestRevisionNote: Re-released for DXP Platform.; Publisher: Altium Limited
P4 P7 = Header 5: Header, 5-Pin; LatestRevisionDate: 17-Jul-2002; LatestRevisionNote: Re-released for DXP Platform.; Publisher: Altium Limited
P5 = Header 7: Header, 7-Pin; LatestRevisionDate: 17-Jul-2002; LatestRevisionNote: Re-released for DXP Platform.; Publisher: Altium Limited
P6 = Header 4: Header, 4-Pin; LatestRevisionDate: 17-Jul-2002; LatestRevisionNote: Re-released for DXP Platform.; Publisher: Altium Limited
P8 = Header 6: Header, 6-Pin; LatestRevisionDate: 17-Jul-2002; LatestRevisionNote: Re-released for DXP Platform.; Publisher: Altium Limited
Q1 Q2 Q5 Q6 Q9 Q10 = APC-817C1-SL: Phototransistor; Manufacturer_Name: American Bright LED; Datasheet Link: https://www.americanbrightled.com/pdffiles/ir-uv/ir/APC-817.pdf; Height: 3.8mm; Manufacturer_Part_Number: APC-817C1-SL; Mouser Part Number: 442-APC817C1SL; Mouser Price/Stock: https://www.mouser.co.uk/ProductDetail/American-Bright-LED/APC-817C1-SL?qs=Y0Uzf4wQF3lGQlk7OLeIsw%3D%3D
Q3 Q4 Q7 Q8 Q11-Q14 = MMBT2222A-G: Transistor BJT NPN; Manufacturer_Name: Comchip Technology; Datasheet Link: https://datasheet.datasheetarchive.com/originals/distributors/Datasheets-7/DSA-138996.pdf; Height: 1.15mm; Manufacturer_Part_Number: MMBT2222A-G; Mouser Part Number: 750-MMBT2222A-G; Mouser Price/Stock: https://www.mouser.co.uk/ProductDetail/Comchip-Technology/MMBT2222A-G?qs=2qJf6qQ4IOIM%2FSE9iCL8gQ%3D%3D; Arrow Part Number: MMBT2222A-G; Arrow Price/Stock: https://www.arrow.com/en/products/mmbt2222a-g/comchip-technology?region=nac
R1 R2 R5 R6 R9 R10 = RT0805FRE07680RL: 125mW Thin Film Resistor ±50ppm/℃ ±1% 680Ω 0805 Chip Resistor - Surface Mount ROHS; Manufacturer: Yageo Group; Manufacturer Package Identifier: 0805 (2012 metric); Temperature Coefficient: 50ppm/°C; Voltage Rating: 150V; Supplier 1: DigiKey; Manufacturer Part Number: RT0805FRE07680RL; RoHS: Compliant; Category: Chip SMD Resistors; Stock 1: 3497; Pricing 1: 1=0.1, 10=0.019, 50=0.0166, 100=0.0157, 500=0.01376 (USD); Case/Package: 0805; Case Code (Imperial): 0805; China RoHS: Non-Compliant; Composition: Thin Film; Contact Plating: Tin; Country of Origin: Mainland China, Taiwan; Export Control Classification Number (ECCN) Code: EAR99; Height: 500µm; Harmonized Tariff Schedule (HTS) Code: 8533.21.00.30; Introduction Date: 2008-07-11; Lead Free: Lead Free; Length: 2mm; Lifecycle Status: Production; Max Operating Temperature: 155°C; Max Power Dissipation: 125mW; Min Operating Temperature: -55°C; Mount: Surface Mount; Number of Pins: 2; Number of Terminals: 2; Number of Terminations: 2; Packaging: Tape & Reel (TR); Power Rating: 125mW; Radiation Hardening: No; REACH SVHC: Yes; Resistance: 680Ω; Tolerance: 1%; Voltage Rating (DC): 150V; Width: 1.25mm; Working Voltage: 150V; ComponentLink1URL: https://datasheet.octopart.com:443/RT0805FRE07680RL-Yageo-datasheet-176402239.pdf?src-supplier=Future+Electronics; ComponentLink1Description: https://datasheet.octopart.com:443/RT0805FRE07680RL-Yageo-datasheet-176402239.pdf?src-supplier=Future+Electronics; ComponentLink2URL: https://datasheet.octopart.com:443/RT0805FRE07680RL-Yageo-datasheet-169971040.pdf?src-supplier=Future+Electronics; ComponentLink2Description: https://datasheet.octopart.com:443/RT0805FRE07680RL-Yageo-datasheet-169971040.pdf?src-supplier=Future+Electronics; ComponentLink3URL: https://datasheet.octopart.com:443/RT0805FRE07680RL-Yageo-datasheet-166250672.pdf?src-supplier=Future+Electronics; ComponentLink3Description: https://datasheet.octopart.com:443/RT0805FRE07680RL-Yageo-datasheet-166250672.pdf?src-supplier=Future+Electronics; ComponentLink4URL: https://datasheet.octopart.com:443/RT0805FRE07680RL-Yageo-datasheet-96443642.pdf?src-supplier=Upverter; ComponentLink4Description: https://datasheet.octopart.com:443/RT0805FRE07680RL-Yageo-datasheet-96443642.pdf?src-supplier=Upverter; ComponentLink5URL: https://datasheet.octopart.com:443/RT0805FRE07680RL-Yageo-datasheet-8324589.pdf?src-supplier=Farnell; ComponentLink5Description: https://datasheet.octopart.com:443/RT0805FRE07680RL-Yageo-datasheet-8324589.pdf?src-supplier=Farnell; ComponentLink6URL: https://datasheet.octopart.com/RT0805FRE07680RL-Yageo-datasheet-86813807.pdf; ComponentLink6Description: https://datasheet.octopart.com/RT0805FRE07680RL-Yageo-datasheet-86813807.pdf; ComponentLink7URL: http://sigma.octopart.com:80/conflict_mineral_statement/Yageo-company-3.pdf?src-supplier=Compliance+Statements; ComponentLink7Description: http://sigma.octopart.com:80/conflict_mineral_statement/Yageo-company-3.pdf?src-supplier=Compliance+Statements; ComponentLink8URL: http://sigma.octopart.com:80/rohs_statement/Yageo-company-2.pdf?src-supplier=Compliance+Statements; ComponentLink8Description: http://sigma.octopart.com:80/rohs_statement/Yageo-company-2.pdf?src-supplier=Compliance+Statements; Supplier Part Number 1: 13-RT0805FRE07680RLCT-ND
R3 R4 R7 R8 R11 R12 = AT0805DRD071KL: Resistor; Manufacturer_Name: Yageo Group; Datasheet Link: https://www.yageo.com/upload/media/product/productsearch/datasheet/rchip/PYu-AT_51_RoHS_L_5.pdf; Height: 0.6mm; Manufacturer_Part_Number: AT0805DRD071KL; Mouser Part Number: 603-AT0805DRD071KL; Mouser Price/Stock: https://www.mouser.com/Search/Refine.aspx?Keyword=603-AT0805DRD071KL
R13 = AF0805FR-074K7L: Res Thick Film 0805 4.7K Ohm 1% 0.125W(1/8W) ±100ppm/C Sulfur Resistant Pad SMD Automotive T/R; Manufacturer: Yageo Group; Max Power Dissipation: 125mW; Temperature Coefficient: 100ppm/°C; Voltage Rating: 150V; Supplier 1: DigiKey; Manufacturer Part Number: AF0805FR-074K7L; RoHS: Compliant; Category: Chip SMD Resistors; Stock 1: 4475; Pricing 1: 1=0.12, 10=0.058, 25=0.0448, 50=0.0372, 100=0.0313, 250=0.0254, 500=0.022, 1000=0.01931 (USD); Case/Package: 0805; China RoHS: Non-Compliant; Composition: Thick Film; Country of Origin: Mainland China, Taiwan; Export Control Classification Number (ECCN) Code: EAR99; Features: Anti-Sulfur, Moisture Resistant; Height: 500µm; Harmonized Tariff Schedule (HTS) Code: 8533.21.00.30; Introduction Date: 2012-05-08; Length: 2mm; Lifecycle Status: Production; Max Operating Temperature: 155°C; Min Operating Temperature: -55°C; Mount: Surface Mount; Number of Terminals: 2; Number of Terminations: 2; Packaging: Tape & Reel; Power Rating: 125mW; Ratings: AEC-Q200; REACH SVHC: Yes; Resistance: 4.7kΩ; Tolerance: 1%; Width: 1.25mm; Working Voltage: 150V; ComponentLink1URL: https://datasheet.octopart.com:443/AF0805FR-074K7L-Yageo-datasheet-182189395.pdf?src-supplier=IHS; ComponentLink1Description: https://datasheet.octopart.com:443/AF0805FR-074K7L-Yageo-datasheet-182189395.pdf?src-supplier=IHS; ComponentLink2URL: https://datasheet.octopart.com:443/AF0805FR-074K7L-Yageo-datasheet-153645569.pdf?src-supplier=Upverter; ComponentLink2Description: https://datasheet.octopart.com:443/AF0805FR-074K7L-Yageo-datasheet-153645569.pdf?src-supplier=Upverter; ComponentLink3URL: https://sigma.octopart.com:443/138820526/technical_drawing/Yageo-AF0805FR-074K7L.pdf?src-supplier=Upverter; ComponentLink3Description: https://sigma.octopart.com:443/138820526/technical_drawing/Yageo-AF0805FR-074K7L.pdf?src-supplier=Upverter; ComponentLink4URL: https://datasheet.octopart.com:443/AF0805FR-074K7L-Yageo-datasheet-164730775.pdf?src-supplier=Future+Electronics; ComponentLink4Description: https://datasheet.octopart.com:443/AF0805FR-074K7L-Yageo-datasheet-164730775.pdf?src-supplier=Future+Electronics; ComponentLink5URL: https://datasheet.octopart.com:443/AF0805FR-074K7L-Yageo-datasheet-137481464.pdf?src-supplier=Future+Electronics; ComponentLink5Description: https://datasheet.octopart.com:443/AF0805FR-074K7L-Yageo-datasheet-137481464.pdf?src-supplier=Future+Electronics; ComponentLink6URL: https://datasheet.octopart.com/AF0805FR-074K7L-Yageo-datasheet-68296209.pdf; ComponentLink6Description: https://datasheet.octopart.com/AF0805FR-074K7L-Yageo-datasheet-68296209.pdf; ComponentLink7URL: http://sigma.octopart.com:80/conflict_mineral_statement/Yageo-company-3.pdf?src-supplier=Compliance+Statements; ComponentLink7Description: http://sigma.octopart.com:80/conflict_mineral_statement/Yageo-company-3.pdf?src-supplier=Compliance+Statements; ComponentLink8URL: http://sigma.octopart.com:80/rohs_statement/Yageo-company-2.pdf?src-supplier=Compliance+Statements; ComponentLink8Description: http://sigma.octopart.com:80/rohs_statement/Yageo-company-2.pdf?src-supplier=Compliance+Statements; Supplier Part Number 1: 13-AF0805FR-074K7LCT-ND
R14-R16 = RC0805FR-0710KL: Res General Purpose Thick Film 0805 10k Ohm 1% 1/8W ±100ppm/°C Ceramic Paper T/R; Manufacturer_Name: Yageo Group; Max Power Dissipation: 125mW; Voltage Rating: 150V; Datasheet Link: https://www.yageo.com/upload/media/product/productsearch/datasheet/rchip/PYu-RC_Group_51_RoHS_L_11.pdf; Height: 0.6mm; Manufacturer_Part_Number: RC0805FR-0710KL; Mouser Part Number: 603-RC0805FR-0710KL; Mouser Price/Stock: https://www.mouser.co.uk/ProductDetail/YAGEO/RC0805FR-0710KL?qs=7bY8808IzHq6vrU3BeiiYw%3D%3D; Arrow Part Number: RC0805FR-0710KL; Arrow Price/Stock: https://www.arrow.com/en/products/rc0805fr0710kl/yageo.html?utm_currency=USD&region=europe; Supplier 1: Future Electronics; Manufacturer: Yageo Group; Manufacturer Part Number: RC0805FR-0710KL; RoHS: Compliant; Category: Chip SMD Resistors; Stock 1: 10960000; Pricing 1: 5000=0.0068, 20000=0.0066, 75000=0.0064, 150000=0.0063, 375000=0.006 (USD); Case/Package: 0805; Case Code (Imperial): 0805; China RoHS: Non-Compliant; Composition: Thick Film; Contact Plating: Tin; Country of Origin: Mainland China, Taiwan; Depth: 1.25mm; Export Control Classification Number (ECCN) Code: EAR99; Features: Moisture Resistant; Harmonized Tariff Schedule (HTS) Code: 8533.21.00.30; Introduction Date: 2004-09-22; Lead Free: Lead Free; Length: 2mm; Lifecycle Status: Production; Max Operating Temperature: 155°C; Military Standard: Not; Min Operating Temperature: -55°C; Mount: Surface Mount; Number of Pins: 2; Number of Terminals: 2; Number of Terminations: 2; Packaging: Tape and Reel; Power Rating: 125mW; Radiation Hardening: No; REACH SVHC: Yes; Resistance: 10kΩ; Schedule B: 8533210045, 8533210045|8533210045|8533210045|8533210045|8533210045|8533210045|8533210045|8533210045|8533210045|8533210045|8533210045|8533210045|8533210045|8533210045|8533210045|8533210045|8533210045|8533210045|8533210045|8533210045|8533210045|8533210045|8533210045|85; Temperature Coefficient: 100ppm/°C; Termination: SMD/SMT; Tolerance: 1%; Voltage Rating (AC): 150V; Voltage Rating (DC): 150V; Width: 1.25mm; Working Voltage: 150V; ComponentLink1URL: https://datasheet.octopart.com:443/RC0805FR-0710KL-Yageo-datasheet-175887523.pdf?src-supplier=Newark; ComponentLink1Description: https://datasheet.octopart.com:443/RC0805FR-0710KL-Yageo-datasheet-175887523.pdf?src-supplier=Newark; ComponentLink2URL: https://datasheet.octopart.com:443/RC0805FR-0710KL-Yageo-datasheet-62067350.pdf?src-supplier=Farnell; ComponentLink2Description: https://datasheet.octopart.com:443/RC0805FR-0710KL-Yageo-datasheet-62067350.pdf?src-supplier=Farnell; ComponentLink3URL: https://datasheet.octopart.com:443/RC0805FR-0710KL-Yageo-datasheet-13691069.pdf?src-supplier=Farnell; ComponentLink3Description: https://datasheet.octopart.com:443/RC0805FR-0710KL-Yageo-datasheet-13691069.pdf?src-supplier=Farnell; ComponentLink4URL: https://datasheet.octopart.com:443/RC0805FR-0710KL-Yageo-datasheet-103092701.pdf?src-supplier=Upverter; ComponentLink4Description: https://datasheet.octopart.com:443/RC0805FR-0710KL-Yageo-datasheet-103092701.pdf?src-supplier=Upverter; ComponentLink5URL: https://datasheet.octopart.com:443/RC0805FR-0710KL-Yageo-datasheet-98239111.pdf?src-supplier=Upverter; ComponentLink5Description: https://datasheet.octopart.com:443/RC0805FR-0710KL-Yageo-datasheet-98239111.pdf?src-supplier=Upverter; ComponentLink6URL: https://datasheet.octopart.com:443/RC0805FR-0710KL-Yageo---Phycomp-datasheet-67302840.pdf?src-supplier=Upverter; ComponentLink6Description: https://datasheet.octopart.com:443/RC0805FR-0710KL-Yageo---Phycomp-datasheet-67302840.pdf?src-supplier=Upverter; ComponentLink7URL: https://datasheet.octopart.com:443/RC0805FR-0710KL-Yageo-datasheet-8330313.pdf?src-supplier=element14+APAC; ComponentLink7Description: https://datasheet.octopart.com:443/RC0805FR-0710KL-Yageo-datasheet-8330313.pdf?src-supplier=element14+APAC; ComponentLink8URL: https://datasheet.octopart.com:443/RC0805FR-0710KL-Yageo-datasheet-12592811.pdf?src-supplier=element14+APAC; ComponentLink8Description: https://datasheet.octopart.com:443/RC0805FR-0710KL-Yageo-datasheet-12592811.pdf?src-supplier=element14+APAC; ComponentLink9URL: https://datasheet.octopart.com:443/RC0805FR-0710KL-Yageo-Group-datasheet-190305687.pdf?src-supplier=Future+Electronics; ComponentLink9Description: https://datasheet.octopart.com:443/RC0805FR-0710KL-Yageo-Group-datasheet-190305687.pdf?src-supplier=Future+Electronics; ComponentLink10URL: https://datasheet.octopart.com:443/RC0805FR-0710KL-Yageo-datasheet-164759695.pdf?src-supplier=Future+Electronics; ComponentLink10Description: https://datasheet.octopart.com:443/RC0805FR-0710KL-Yageo-datasheet-164759695.pdf?src-supplier=Future+Electronics; ComponentLink11URL: https://datasheet.octopart.com:443/RC0805FR-0710KL-Yageo-datasheet-15800360.pdf?src-supplier=Future+Electronics; ComponentLink11Description: https://datasheet.octopart.com:443/RC0805FR-0710KL-Yageo-datasheet-15800360.pdf?src-supplier=Future+Electronics; ComponentLink12URL: https://datasheet.octopart.com:443/RC0805FR-0710KL-Yageo-datasheet-8324252.pdf?src-supplier=Future+Electronics; ComponentLink12Description: https://datasheet.octopart.com:443/RC0805FR-0710KL-Yageo-datasheet-8324252.pdf?src-supplier=Future+Electronics; ComponentLink13URL: https://datasheet.octopart.com:443/RC0805FR-0710KL-Yageo-datasheet-79472498.pdf?src-supplier=Megastar; ComponentLink13Description: https://datasheet.octopart.com:443/RC0805FR-0710KL-Yageo-datasheet-79472498.pdf?src-supplier=Megastar; ComponentLink14URL: https://datasheet.octopart.com:443/RC0805FR-0710KL-Yageo-datasheet-27714392.pdf?src-supplier=Seeed+Studio; ComponentLink14Description: https://datasheet.octopart.com:443/RC0805FR-0710KL-Yageo-datasheet-27714392.pdf?src-supplier=Seeed+Studio; ComponentLink15URL: https://datasheet.octopart.com/RC0805FR-0710KL-Yageo-datasheet-73766026.pdf; ComponentLink15Description: https://datasheet.octopart.com/RC0805FR-0710KL-Yageo-datasheet-73766026.pdf; ComponentLink16URL: https://datasheet.octopart.com:443/RC0805FR-0710KL-Yageo-datasheet-118657.pdf?src-supplier=DigiKey; ComponentLink16Description: https://datasheet.octopart.com:443/RC0805FR-0710KL-Yageo-datasheet-118657.pdf?src-supplier=DigiKey; ComponentLink17URL: https://datasheet.octopart.com:443/RC0805FR-0710KL-Yageo-datasheet-502840.pdf?src-supplier=element14; ComponentLink17Description: https://datasheet.octopart.com:443/RC0805FR-0710KL-Yageo-datasheet-502840.pdf?src-supplier=element14; ComponentLink18URL: http://sigma.octopart.com:80/conflict_mineral_statement/Yageo-company-3.pdf?src-supplier=Compliance+Statements; ComponentLink18Description: http://sigma.octopart.com:80/conflict_mineral_statement/Yageo-company-3.pdf?src-supplier=Compliance+Statements; ComponentLink19URL: http://sigma.octopart.com:80/rohs_statement/Yageo-company-2.pdf?src-supplier=Compliance+Statements; ComponentLink19Description: http://sigma.octopart.com:80/rohs_statement/Yageo-company-2.pdf?src-supplier=Compliance+Statements; Supplier Part Number 1: RC0805FR-0710KL
S1 S2 = TL1105AF160Q: Switch; Manufacturer_Name: E-Switch; Datasheet Link: https://configured-product-images.s3.amazonaws.com/2D/specs/TL1105CF250Q.pdf; Height: 6.8mm; Manufacturer_Part_Number: TL1105AF160Q; Mouser Part Number: 612-TL1105A; Mouser Price/Stock: https://www.mouser.co.uk/ProductDetail/E-Switch/TL1105AF160Q?qs=YXf4ACKMM4wdc4witUH7eQ%3D%3D